# EasyEDA schematic 6502v2 lcd.json
TITLE: Sheet_1; REV: 1.0; Date: 2023-08-14; Sheet: 1/1; Drawn By: breckcmassey; Company: Your Company
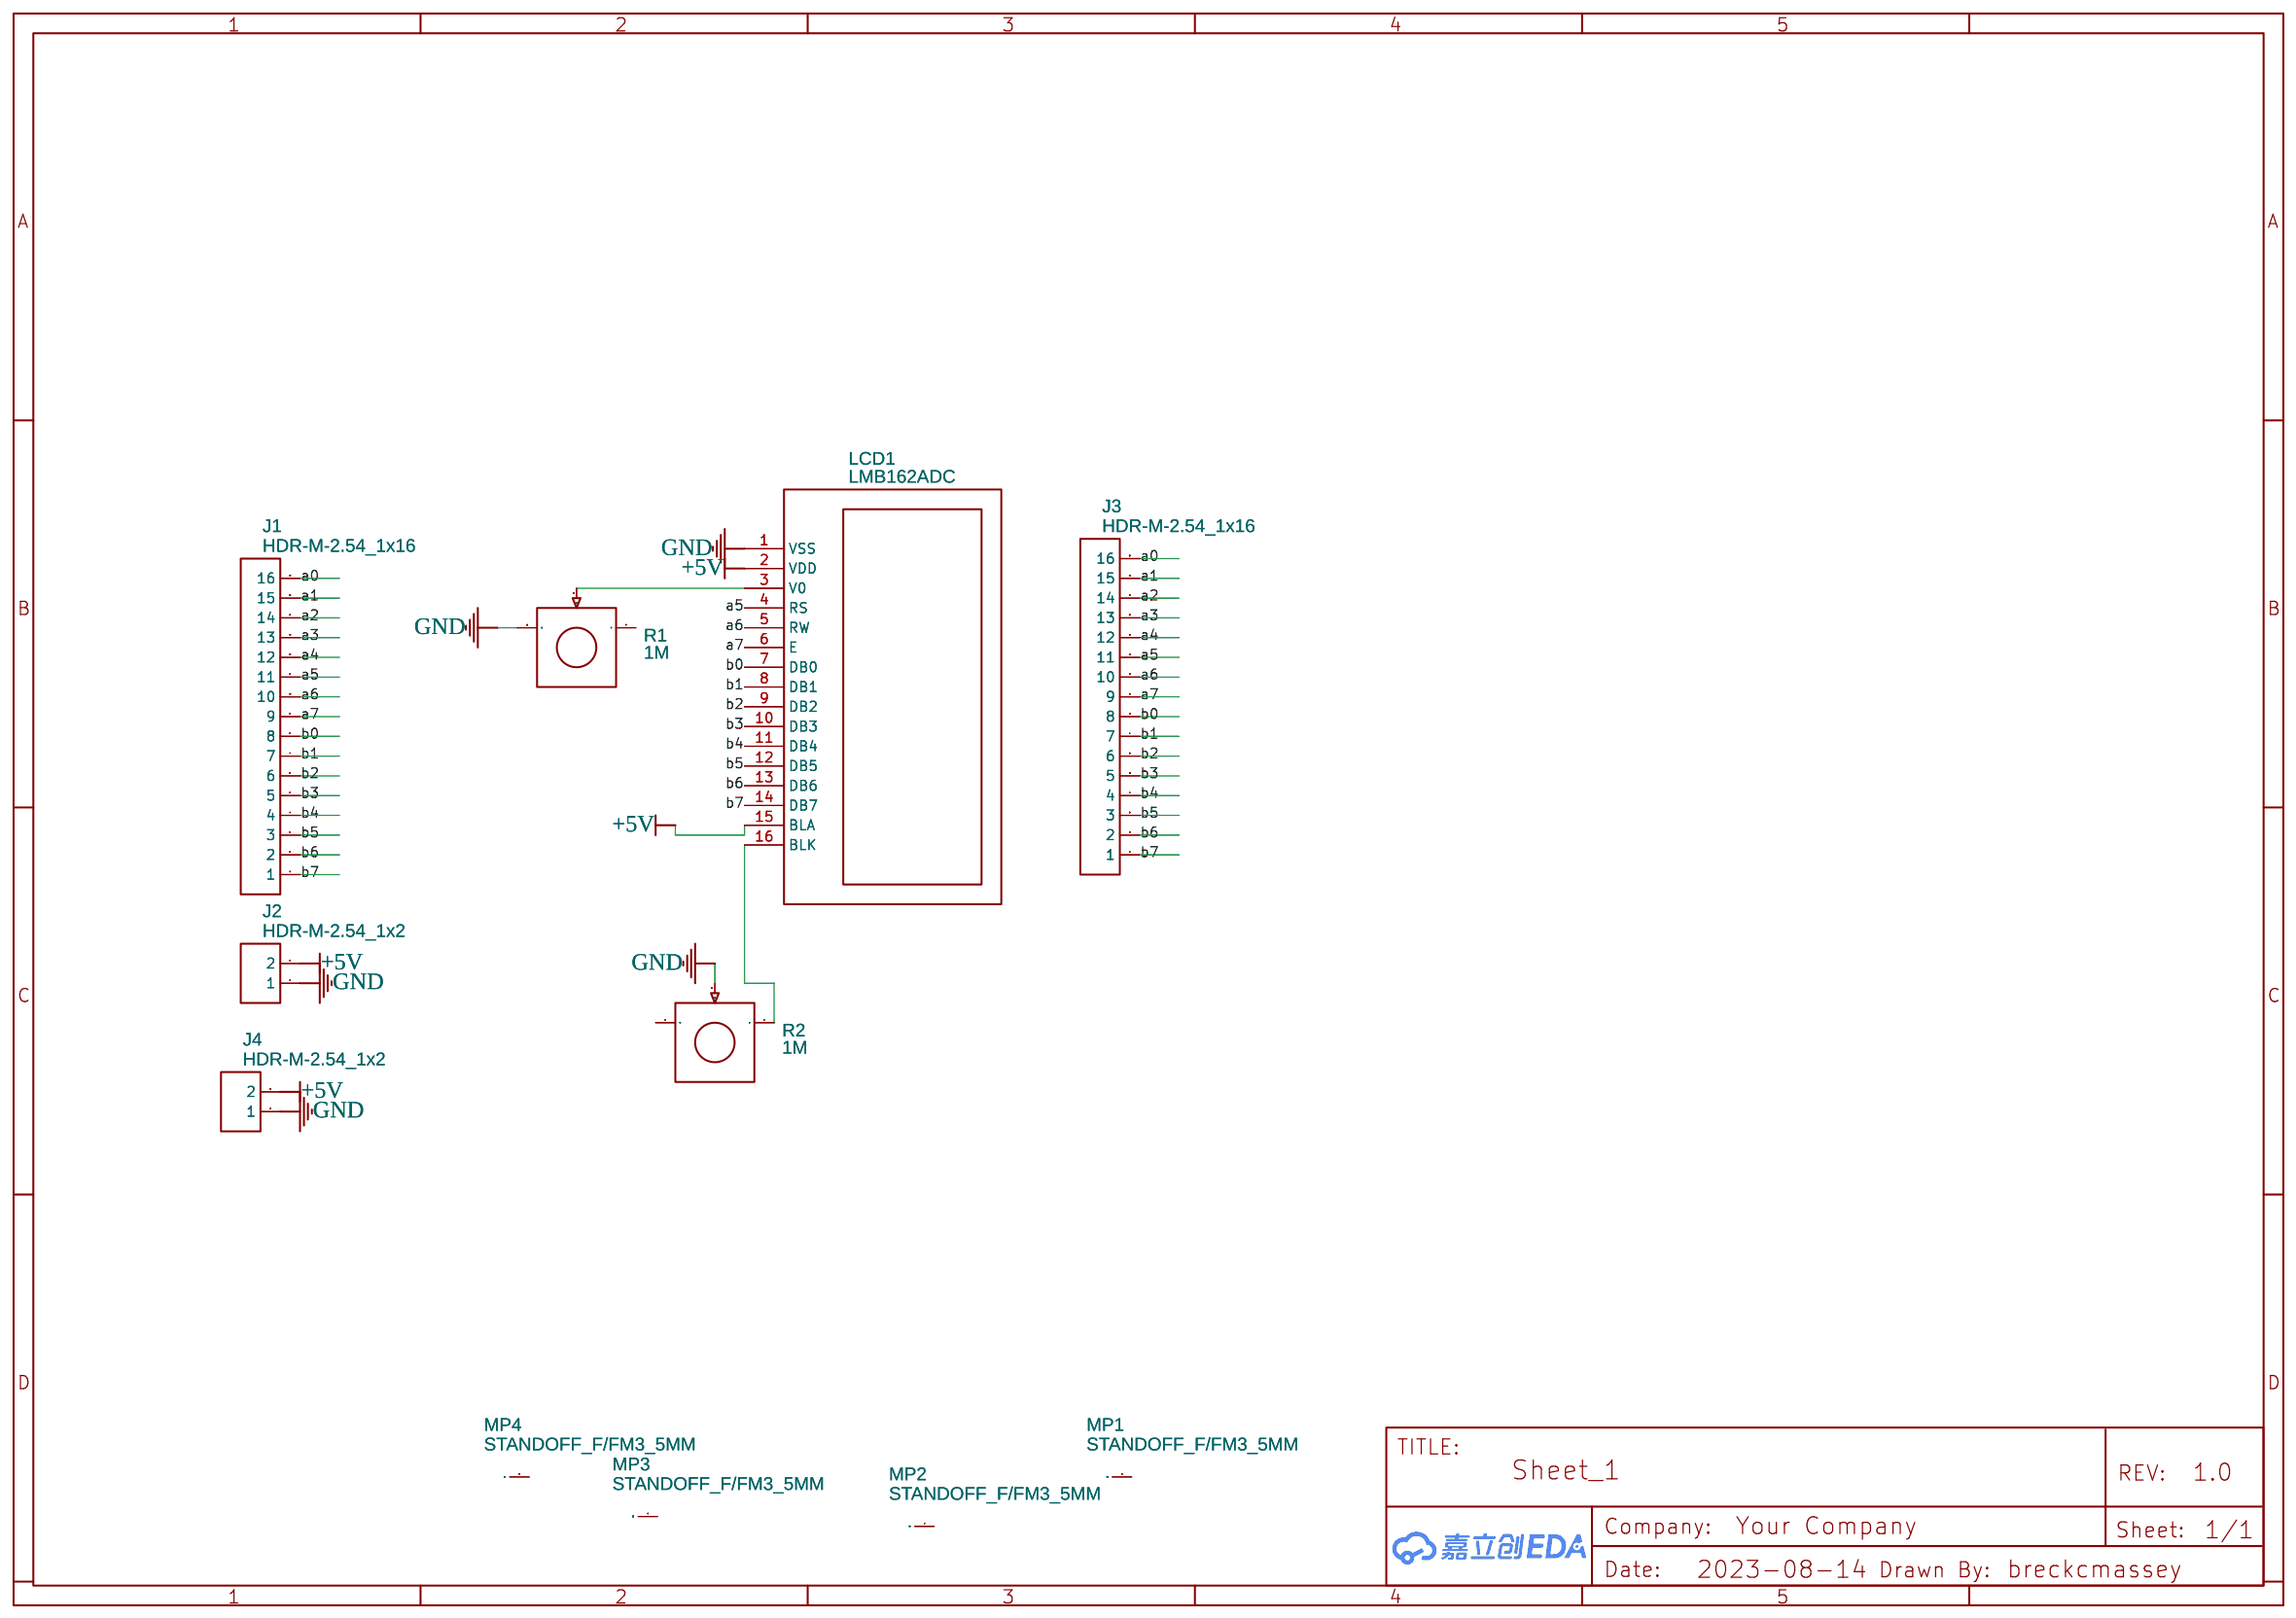
[diagram p0: schematic sheet]

## Parts
J1  HDR-M-2.54_1x16  [HDR-M-2.54_1X16]
J2  HDR-M-2.54_1x2  [HDR-M-2.54_1X2]
J3  HDR-M-2.54_1x16  [HDR-M-2.54_1X16]
J4  HDR-M-2.54_1x2  [HDR-M-2.54_1X2]
LCD1  LMB162ADC  [LCD1602]
MP1  STANDOFF_F/FM3_5MM  [STANDOFF_HEX_FEMALE_550X500_M3X0.5_MTGP850H320]
MP2  STANDOFF_F/FM3_5MM  [STANDOFF_HEX_FEMALE_550X500_M3X0.5_MTGP850H320]
MP3  STANDOFF_F/FM3_5MM  [STANDOFF_HEX_FEMALE_550X500_M3X0.5_MTGP850H320]
MP4  STANDOFF_F/FM3_5MM  [STANDOFF_HEX_FEMALE_550X500_M3X0.5_MTGP850H320]
R1  1M  [3386T]
R2  1M  [3386T]

## Library data of the parts
J1 J3 = HDR-M-2.54_1x16: Supplier: LCSC; Contributor: LCEDA_Lib
J2 J4 = HDR-M-2.54_1x2: Supplier Part: C124375; Supplier: LCSC; Contributor: LCEDA_Lib
LCD1 = LMB162ADC: Supplier: LCSC; Manufacturer: TOPWAY; Supplier Part: C9741
MP1-MP4 = STANDOFF_F/FM3_5MM
R1 R2 = 3/8 Inch Square Cermet Potentiometer 1MEG Ohms 1/2 Watt 1 Turn Thru Hole: Manufacturer: Jameco ValuePro; Manufacturer Part: 3386T-1-LS1MEG(105); Supplier Part: 2161422; link: https://www.jameco.com/webapp/wcs/stores/servlet/ProductDisplay?storeId=10001&langId=-1&catalogId=10001&productId=2161422; Contributor: dissy614

## Nets
+5V: J2.2 J4.2 LCD1.2(VDD) LCD1.15(BLA)
GND: J2.1 J4.1 LCD1.1(VSS) R1.3 R2.2
a0: J1.16 J3.16
a1: J1.15 J3.15
a2: J1.14 J3.14
a3: J1.13 J3.13
a4: J1.12 J3.12
a5: J1.11 J3.11 LCD1.4(RS)
a6: J1.10 J3.10 LCD1.5(RW)
a7: J1.9 J3.9 LCD1.6(E)
b0: J1.8 J3.8 LCD1.7(DB0)
b1: J1.7 J3.7 LCD1.8(DB1)
b2: J1.6 J3.6 LCD1.9(DB2)
b3: J1.5 J3.5 LCD1.10(DB3)
b4: J1.4 J3.4 LCD1.11(DB4)
b5: J1.3 J3.3 LCD1.12(DB5)
b6: J1.2 J3.2 LCD1.13(DB6)
b7: J1.1 J3.1 LCD1.14(DB7)
Net-(LCD1-3): LCD1.3(V0) R1.2
Net-(LCD1-16): LCD1.16(BLK) R2.1

Not connected (* = marked no-connect by the designer): MP1 1(P$1); MP2 1(P$1); MP3 1(P$1); MP4 1(P$1); R1 1; R2 3
